# Altium schematic sheet CON_PCI_Express_X1_36PIN.SchDoc: PCI Express x1 36Pin
size A4
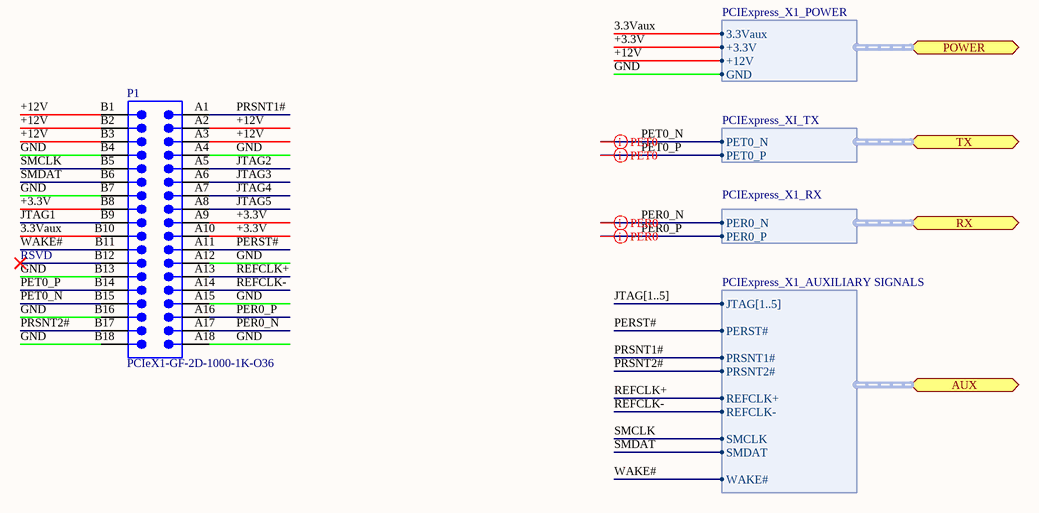
[diagram p0: CON_PCI_Express_X1_36PIN.SchDoc]

## Parts
P1  PCIeX1-GF-2D-1000-1K-O36  [PCIeX1-GF-2D-1000-1K-O36]  (no BOM)

## Ports
AUX (harness PCIExpress_X1_AUXILIARY SIGNALS), POWER (harness PCIExpress_X1_POWER), RX (harness PCIExpress_X1_RX), TX (harness PCIExpress_XI_TX)

## Harnesses
PCIExpress_X1_RX: PER0_N, PER0_P
PCIExpress_XI_TX: PET0_N, PET0_P
PCIExpress_X1_POWER: +3.3V, +12V, GND, 3.3Vaux
PCIExpress_X1_AUXILIARY SIGNALS: JTAG[1..5], PERST#, PRSNT1#, PRSNT2#, REFCLK+, REFCLK-, SMCLK, SMDAT, WAKE#

## Nets
3.3Vaux: P1.B10 ; port POWER.3.3Vaux
+3.3V: P1.A9 P1.A10 P1.B8 ; port POWER.+3.3V
+12V: P1.A2 P1.A3 P1.B1 P1.B2 P1.B3 ; port POWER.+12V
GND: P1.A4 P1.A12 P1.A15 P1.A18 P1.B4 P1.B7 P1.B13 P1.B16 P1.B18 ; port POWER.GND
JTAG1: P1.B9
JTAG2: P1.A5
JTAG3: P1.A6
JTAG4: P1.A7
JTAG5: P1.A8
PER0_N: P1.A17 ; port RX.PER0_N
PER0_P: P1.A16 ; port RX.PER0_P
PERST#: P1.A11 ; port AUX.PERST#
PET0_N: P1.B15 ; port TX.PET0_N
PET0_P: P1.B14 ; port TX.PET0_P
PRSNT1#: P1.A1 ; port AUX.PRSNT1#
PRSNT2#: P1.B17 ; port AUX.PRSNT2#
REFCLK+: P1.A13 ; port AUX.REFCLK+
REFCLK-: P1.A14 ; port AUX.REFCLK-
SMCLK: P1.B5 ; port AUX.SMCLK
SMDAT: P1.B6 ; port AUX.SMDAT
WAKE#: P1.B11 ; port AUX.WAKE#

Not connected (* = marked no-connect by the designer): P1 B12*

## Buses and harness runs
bus JTAG[1..5]

## Layout directives
differential pair: PER0_N, PER0_P, PET0_N, PET0_P

## Notes on the sheet
- RSVD
- Sheet Title
- Project Title
- Size:
- Date:
- A4
- Item:
- Time:
- Revision:
- Sheet
- of
- File:

## Library data of the parts
P1 = CMP-0001-00030-2: Golden finger, PCIeX1, Dual, Opposite, Pitch 1mm, 36-Position; Mating Connector: Molex-87715-9006; Package Reference: PCIeX1-GF-2D-1000-1K-O36; ClassName: Edge Connector; Publisher: Altium; Datasheet Version: rev2.0, Apr-2007